# EAGLE design zegarek_v1.0 (EAGLE 6.2)
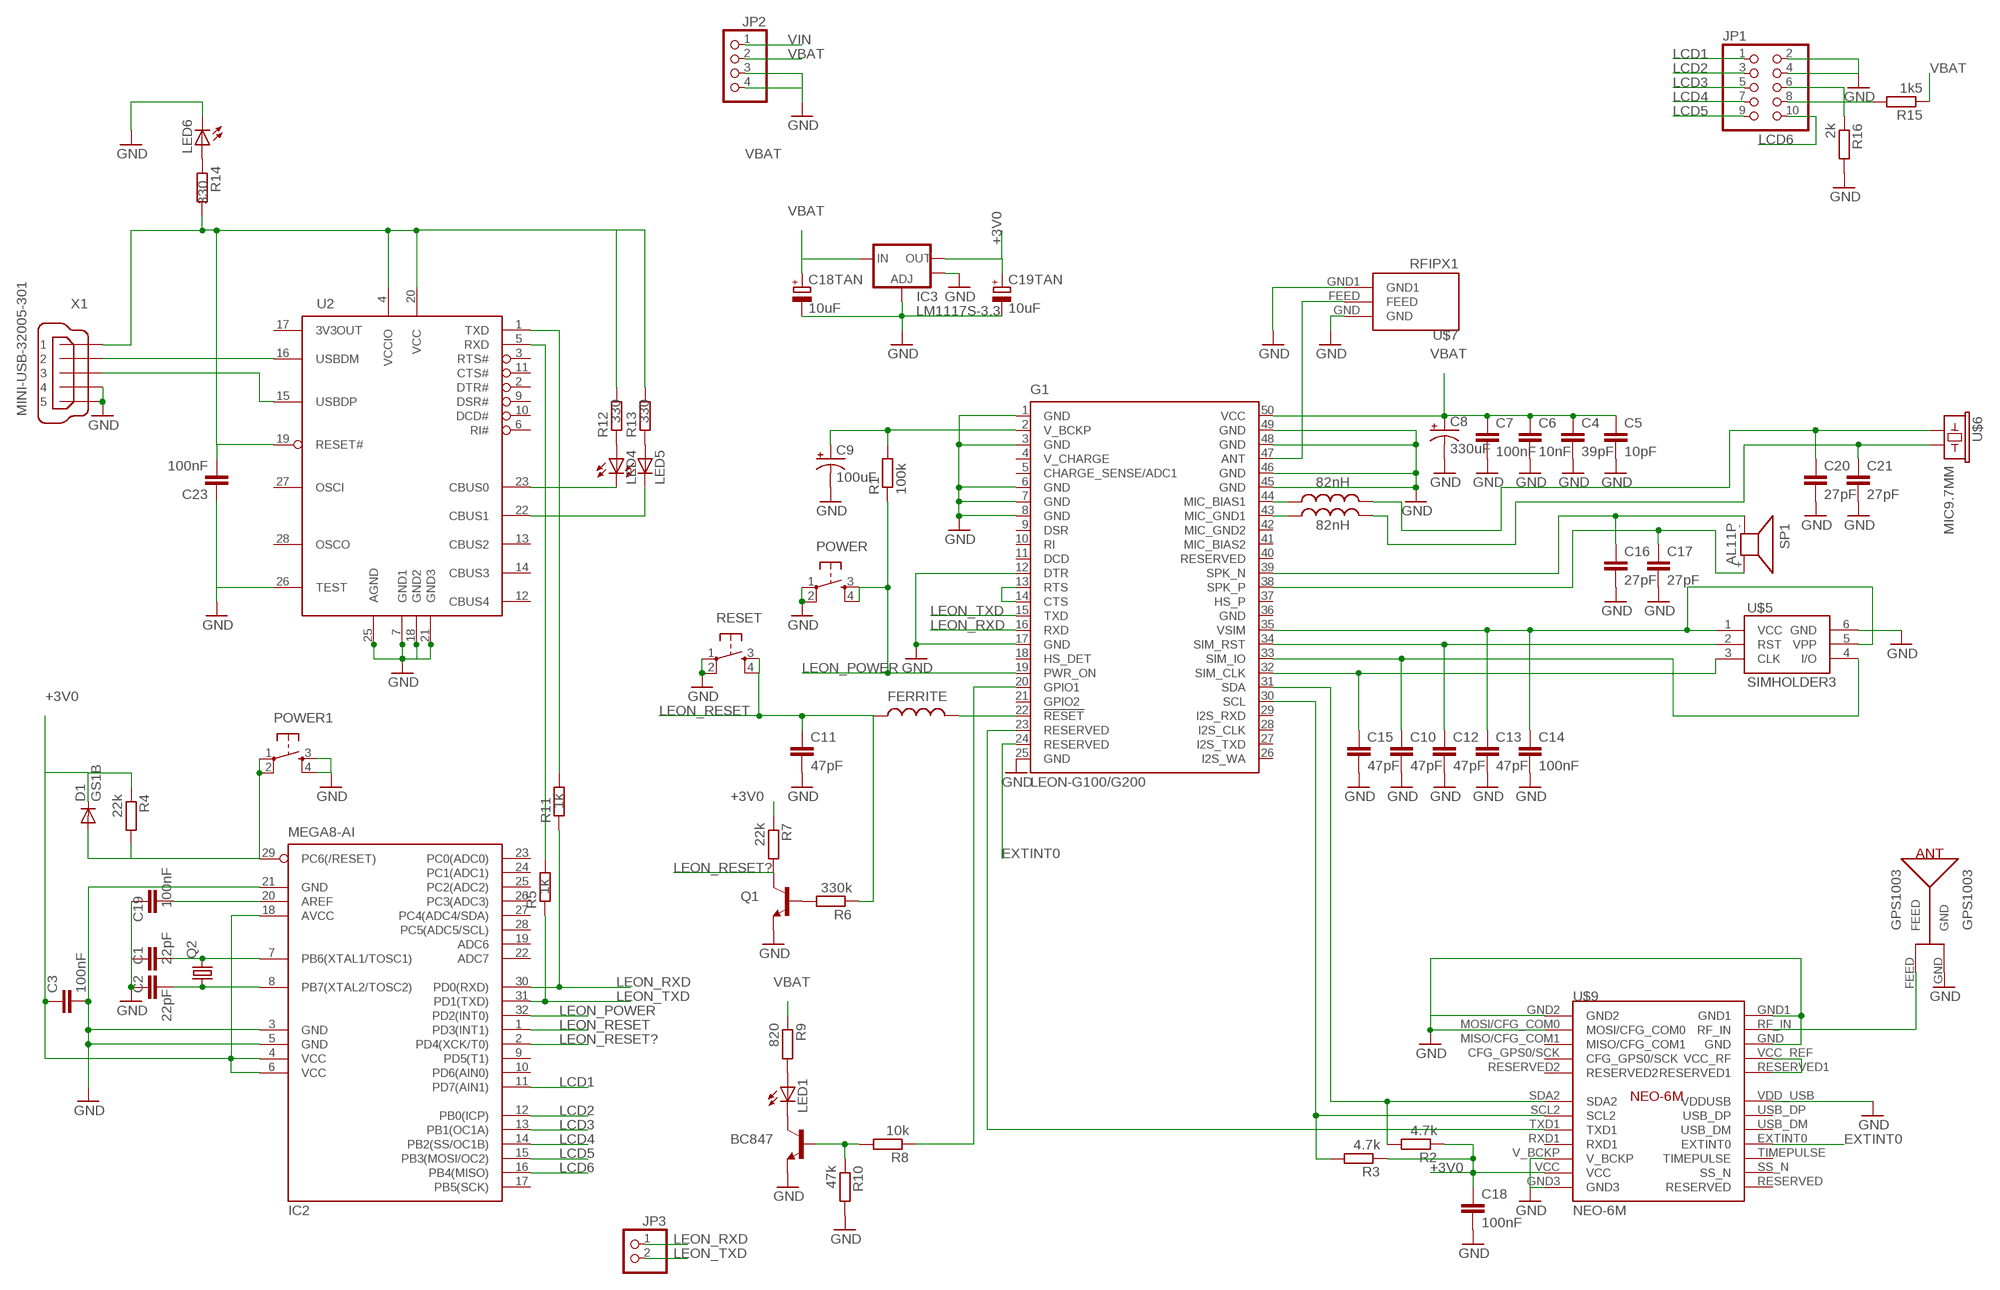
[diagram p0: schematic, sheet 1]

## Parts
BC847  TRANSISTOR_NPNSOT23  [SOT23]
C1  22pF  C-EUC0805  [C0805]
C2  22pF  C-EUC0805  [C0805]
C3  100nF  C-EUC0805  [C0805]
C4  39pF  C-EUC0805  [C0805]
C5  10pF  C-EUC0805  [C0805]
C6  10nF  C-EUC0805  [C0805]
C7  100nF  C-EUC0805  [C0805]
C8  330uF  CPOL-USTT2D6  [TT2D6]
C9  100uF  CPOL-USTT2D6  [TT2D6]
C10  47pF  C-EUC0805  [C0805]
C11  47pF  C-EUC0805  [C0805]
C12  47pF  C-EUC0805  [C0805]
C13  47pF  C-EUC0805  [C0805]
C14  100nF  C-EUC0805  [C0805]
C15  47pF  C-EUC0805  [C0805]
C16  27pF  C-EUC0805  [C0805]
C17  27pF  C-EUC0805  [C0805]
C18  100nF  C-EUC0805  [C0805]
C18TAN  10uF  CPOL-EUSMCA  [SMC_A]
C19  100nF  C-EUC0805  [C0805]
C19TAN  10uF  CPOL-EUSMCA  [SMC_A]
C20  27pF  C-EUC0805  [C0805]
C21  27pF  C-EUC0805  [C0805]
C23  100nF  C-EUC0805  [C0805]
D1  GS1B  DIODE-DO214AC  [DO214AC]
FERRITE  INDUCTOR0805  [0805]
FERRITE1  82nH  INDUCTOR0805  [0805]
FERRITE2  82nH  INDUCTOR0805  [0805]
G1  LEON-G100/G200  [LEON-G100/G200]
GPS1003  GPS1003  [GPS1003]
IC2  MEGA8-AI  [TQFP32-08]
IC3  LM1117S-3.3  V_REG_LM1117SOT223  [SOT223]
JP1  PINHD-2X5  [2X05]
JP2  PINHD-1X4  [1X04]
JP3  PINHD-1X2  [1X02]
LED1  LEDSMT1206  [1206]
LED4  LEDSMT1206  [1206]
LED5  LEDSMT1206  [1206]
LED6  LEDSMT1206  [1206]
POWER  TAC_SWITCHSMD  [TACTILE_SWITCH_SMD]
POWER1  TAC_SWITCHSMD  [TACTILE_SWITCH_SMD]
Q1  TRANSISTOR_NPNSOT23  [SOT23]
Q2  CRYSTALHC49S  [HC49/S]
R1  100k  R-EU_R0805  [R0805]
R2  4.7k  R-EU_R0805  [R0805]
R3  4.7k  R-EU_R0805  [R0805]
R4  22k  R-EU_R0805  [R0805]
R5  1k  R-EU_R0805  [R0805]
R6  330k  R-EU_R0805  [R0805]
R7  22k  R-EU_R0805  [R0805]
R8  10k  R-EU_R0805  [R0805]
R9  820  R-EU_R0805  [R0805]
R10  47k  R-EU_R0805  [R0805]
R11  1k  R-EU_R0805  [R0805]
R12  330  R-EU_R0805  [R0805]
R13  330  R-EU_R0805  [R0805]
R14  330  R-EU_R0805  [R0805]
R15  1k5  R-EU_R0805  [R0805]
R16  2k  R-EU_R0805  [R0805]
RESET  TAC_SWITCHSMD  [TACTILE_SWITCH_SMD]
SP1  AL11P  [AL11P]
U2  FT232RL  [SSOP28DB]
U$5  SIMHOLDER3  [SIMHOLDER3]
U$6  MIC9.7MM  [MIC-9.7MM]
U$7  RFIPX1  [RF-IPX1]
U$9  NEO-6M  [NEO-6M]
X1  MINI-USB-32005-301  [32005-301]

## Nets
+3V0: C3.1 C18.1 C19TAN.+ D1.C IC2.4(VCC) IC2.6(VCC) IC2.18(AVCC) IC3.2(OUT) R2.1 R3.1 R4.1 R7.1 U$9.VCC
EXTINT0: G1.24(RESERVED) U$9.EXTINT0
GND: BC847.2(E) C1.1 C2.1 C3.2 C4.2 C5.2 C6.2 C7.2 C8.- C9.- C10.2 C11.2 C12.2 C13.2 C14.2 C15.2 C16.2 C17.2 C18.2 C18TAN.- C19.2 C19TAN.- C20.2 C21.2 C23.1 G1.1(GND) G1.3(GND) G1.6(GND) G1.7(GND) G1.8(GND) G1.12(DTR) G1.17(GND) G1.25(GND) G1.45(GND) G1.46(GND) G1.48(GND) G1.49(GND) GPS1003.GND IC2.3(GND) IC2.5(GND) IC2.21(GND) IC3.1(ADJ) IC3.4(OUT) JP1.2 JP1.4 JP2.3 LED6.C POWER1.3 POWER1.4 POWER.1 POWER.2 Q1.2(E) R10.2 R16.2 RESET.1 RESET.2 U2.7(GND1) U2.18(GND2) U2.21(GND3) U2.25(AGND) U2.26(TEST) U$5.6(GND) U$7.GND U$7.GND1 U$9.GND U$9.GND1 U$9.GND2 U$9.GND3 U$9.MOSI/CFG_COM0 U$9.V_BCKP U$9.VDD_USB(VDDUSB) X1.4 X1.5
LCD1: IC2.11(PD7(AIN1)) JP1.1
LCD2: IC2.12(PB0(ICP)) JP1.3
LCD3: IC2.13(PB1(OC1A)) JP1.5
LCD4: IC2.14(PB2(SS/OC1B)) JP1.7
LCD5: IC2.15(PB3(MOSI/OC2)) JP1.9
LCD6: IC2.16(PB4(MISO)) JP1.10
LEON_POWER: G1.19(PWR_ON) IC2.32(PD2(INT0)) POWER.3 POWER.4 R1.1
LEON_RESET: C11.1 FERRITE.1 IC2.1(PD3(INT1)) R6.1 RESET.3 RESET.4
LEON_RESET?: IC2.2(PD4(XCK/T0)) Q1.3(C) R7.2
LEON_RXD: G1.16(RXD) IC2.30(PD0(RXD)) JP3.1 R11.1
LEON_TXD: G1.15(TXD) IC2.31(PD1(TXD)) JP3.2 R5.1
N$1: FERRITE.2 G1.22(!RESET)
N$2: C2.2 IC2.8(PB7(XTAL2/TOSC2)) Q2.1
N$3: C9.+ G1.2(V_BCKP) R1.2
N$4: C13.1 C14.1 G1.35(VSIM) U$5.1(VCC) U$5.5(VPP)
N$5: C15.1 G1.32(SIM_CLK) U$5.3(CLK)
N$6: C12.1 G1.34(SIM_RST) U$5.2(RST)
N$7: C16.1 G1.39(SPK_N) SP1.-
N$8: C10.1 G1.33(SIM_IO) U$5.4(I/O)
N$9: C17.1 G1.38(SPK_P) SP1.+
N$10: G1.13(RTS) G1.14(CTS)
N$11: FERRITE1.1 G1.44(MIC_BIAS1)
N$12: FERRITE2.1 G1.43(MIC_GND1)
N$13: C20.1 FERRITE1.2 U$6.1
N$14: C21.1 FERRITE2.2 U$6.2
N$15: Q1.1(B) R6.2
N$16: BC847.1(B) R8.2 R10.1
N$17: LED1.A R9.2
N$18: BC847.3(C) LED1.C
N$19: G1.20(GPIO1) R8.1
N$20: G1.47(ANT) U$7.FEED
N$21: JP1.6 R16.1
N$23: GPS1003.FEED U$9.RF_IN
N$24: G1.31(SDA) R2.2 U$9.SDA2
N$25: U$9.RESERVED1 U$9.VCC_REF(VCC_RF)
N$26: G1.30(SCL) R3.2 U$9.SCL2
N$27: G1.23(RESERVED) U$9.TXD1
N$28: C1.2 IC2.7(PB6(XTAL1/TOSC1)) Q2.2
N$29: D1.A IC2.29(PC6(/RESET)) POWER1.1 POWER1.2 R4.2
N$30: C19.1 IC2.20(AREF)
N$31: LED4.A R12.1
N$32: LED5.A R13.1
N$33: LED4.C U2.23(CBUS0)
N$34: LED5.C U2.22(CBUS1)
N$35: R11.2 U2.1(TXD)
N$36: R5.2 U2.5(RXD)
N$38: JP1.8 R15.2
N$40: JP2.4
N$47: C23.2 R12.2 R13.2 R14.2 U2.4(VCCIO) U2.19(RESET#) U2.20(VCC) X1.1
N$48: U2.16(USBDM) X1.2
N$49: U2.15(USBDP) X1.3
N$51: LED6.A R14.1
VBAT: C4.1 C5.1 C6.1 C7.1 C8.+ C18TAN.+ G1.50(VCC) IC3.3(IN) JP2.2 R9.1 R15.1
VIN: JP2.1
Unconnected: G1.4(V_CHARGE) G1.5(CHARGE_SENSE/ADC1) G1.9(DSR) G1.10(RI) G1.11(DCD) G1.18(HS_DET) G1.21(GPIO2) G1.26(I2S_WA) G1.27(I2S_TXD) G1.28(I2S_CLK) G1.29(I2S_RXD) G1.37(HS_P) G1.40(RESERVED) G1.41(MIC_BIAS2) G1.42(MIC_GND2) IC2.9(PD5(T1)) IC2.10(PD6(AIN0)) IC2.17(PB5(SCK)) IC2.19(ADC6) IC2.22(ADC7) IC2.23(PC0(ADC0)) IC2.24(PC1(ADC1)) IC2.25(PC2(ADC2)) IC2.26(PC3(ADC3)) IC2.27(PC4(ADC4/SDA)) IC2.28(PC5(ADC5/SCL)) U2.2(DTR#) U2.3(RTS#) U2.6(RI#) U2.9(DSR#) U2.10(DCD#) U2.11(CTS#) U2.12(CBUS4) U2.13(CBUS2) U2.14(CBUS3) U2.17(3V3OUT) U2.27(OSCI) U2.28(OSCO) U$9.CFG_GPS0/SCK U$9.MISO/CFG_COM1 U$9.RESERVED U$9.RESERVED2 U$9.RXD1 U$9.SS_N U$9.TIMEPULSE U$9.USB_DM U$9.USB_DP

## Power pins joined to a net without a drawn wire
GND: G1.36(GND)

## Library data of the parts
BC847 Q1 = SparkFun:TRANSISTOR_NPN: Transistor NPN BJT configuration in SOT23 package. MMBT2222 is the common NPN we use. Double check BCE configuration again layout.
C1-C7 C10-C21 C23 = rcl:C-EU: CAPACITOR, European symbol
C8 C9 = rcl:CPOL-US: POLARIZED CAPACITOR, American symbol
C18TAN C19TAN = rcl:CPOL-EU: POLARIZED CAPACITOR, European symbol
D1 = diode:DIODE-: DIODE
FERRITE FERRITE1 FERRITE2 = SparkFun:INDUCTOR: Inductors Basic Inductor/Choke - 0603 and 1206. Footprints are not proven and vary greatly between part numbers.
G1 = u-blox-1:LEON-G100/G200: LEON-G100/G200 Quad Band GSM/GPRS Voice and Data Modules Source: http://www.u-blox.com; OC_FARNELL: unknown; OC_NEWARK: unknown
GPS1003 = u-blox_NEO-6M:GPS1003
IC2 = atmel:MEGA8: MICROCONTROLLER 8 Kbytes FLASH, 1 kbytes SRAM, 512 bytes EEPROM, USART, 6-channel 10 bit ADC, 2-channel 8 bit ADC Pin compatible with Atmega48, ATMega88, ATMega168 Source: avr.lbr; MPN: ATMEGA8-16AU; OC_FARNELL: 9171371; OC_NEWARK: 73M8863
IC3 = SparkFun:V_REG_LM1117: Voltage Regulator LM1117 Standard adjustable voltage regulator but in SMD form. Spark Fun Electronics SKU : COM-00595
JP1 = pinhead:PINHD-2X5: PIN HEADER
JP2 = pinhead:PINHD-1X4: PIN HEADER
JP3 = pinhead:PINHD-1X2: PIN HEADER
LED1 LED4-LED6 = led:LED: LED OSRAM: - CHIPLED LG R971, LG N971, LY N971, LG Q971, LY Q971, LO R971, LY R971 LH N974, LH R974 LS Q976, LO Q976, LY Q976 LO Q996 - Hyper CHIPLED LW Q18S LB Q993, LB Q99A, LB R99A - SideLED LS A670, LO A670, LY A670, LG A670, LP A670 LB A673, LV A673, LT A673, LW A673 LH A674 LY A675 LS A676, LA A676, LO A676, LY A676, LW A676 LS A679, LY A679, LG A679 - Hyper Micro SIDELED® LS Y876, LA Y876, LO Y876, LY Y876 LT Y87S - SmartLED LW L88C, LW L88S LB L89C, LB L89S, LG L890 LS L89K, LO L89K, LY L89K LS L896, LA L896, LO L896, LY L896 - TOPLED LS T670, LO T670, LY T670, LG T670, LP T670 LSG T670, LSP T670, LSY T670, LOP T670, LYG T670 LG T671, LOG T671, LSG T671 LB T673, LV T673, LT T673, LW T673 LH T674 LS T676, LA T676, LO T676, LY T676, LB T676, LH T676, LSB T676, LW T676 LB T67C, LV T67C, LT T67C, LS T67K, LO T67K, LY T67K, LW E67C LS E67B, LA E67B, LO E67B, LY E67B, LB E67C, LV E67C, LT E67C LW T67C LS T679, LY T679, LG T679 LS T770, LO T770, LY T770, LG T770, LP T770 LB T773, LV T773, LT T773, LW T773 LH T774 LS E675, LA E675, LY E675, LS T675 LS T776, LA T776, LO T776, LY T776, LB T776 LHGB T686 LT T68C, LB T68C - Hyper Mini TOPLED® LB M676 - Mini TOPLED Santana® LG M470 LS M47K, LO M47K, LY M47K Source: http://www.osram.convergy.de LUXEON: - LUMILED® LXK2-PW12-R00, LXK2-PW12-S00, LXK2-PW14-U00, LXK2-PW14-V00 LXK2-PM12-R00, LXK2-PM12-S00, LXK2-PM14-U00 LXK2-PE12-Q00, LXK2-PE12-R00, LXK2-PE12-S00, LXK2-PE14-T00, LXK2-PE14-U00 LXK2-PB12-K00, LXK2-PB12-L00, LXK2-PB12-M00, LXK2-PB14-N00, LXK2-PB14-P00, LXK2-PB14-Q00 LXK2-PR12-L00, LXK2-PR12-M00, LXK2-PR14-Q00, LXK2-PR14-R00 LXK2-PD12-Q00, LXK2-PD12-R00, LXK2-PD12-S00 LXK2-PH12-R00, LXK2-PH12-S00 LXK2-PL12-P00, LXK2-PL12-Q00, LXK2-PL12-R00 Source: www.luxeon.com KINGBRIGHT: KA-3528ASYC Source: www.kingbright.com
POWER POWER1 RESET = SparkFun:TAC_SWITCH: Momentary Switch Button commonly used for reset or general input. Spark Fun Electronics SKU : COM-00097
Q2 = crystal:CRYSTAL: CRYSTAL; OC_FARNELL: 1667008; OC_NEWARK: unknown
R1-R16 = rcl:R-EU_: RESISTOR, European symbol
SP1 = buzzer:AL11P: SPEAKER Source: Buerklin; OC_FARNELL: unknown; OC_NEWARK: unknown
U2 = ftdichip-5:FT232RL: USB UART 4th Generation USB UART (USB <-> Serial) Controller
U$5 = SparkFun:SIMHOLDER3
U$6 = SparkFun:MIC: Microphone Omni-directional electret microphone. 9.7mm standard diameter.
U$7 = RFIPX:RFIPX1
U$9 = u-blox_NEO-6M:NEO-6M
X1 = con-cypressindustries:MINI-USB-: MINI USB-B Conector Source: www.cypressindustries.com; OC_FARNELL: unknown; OC_NEWARK: unknown

## Net classes
0 default: width 0.203 mm

## Board
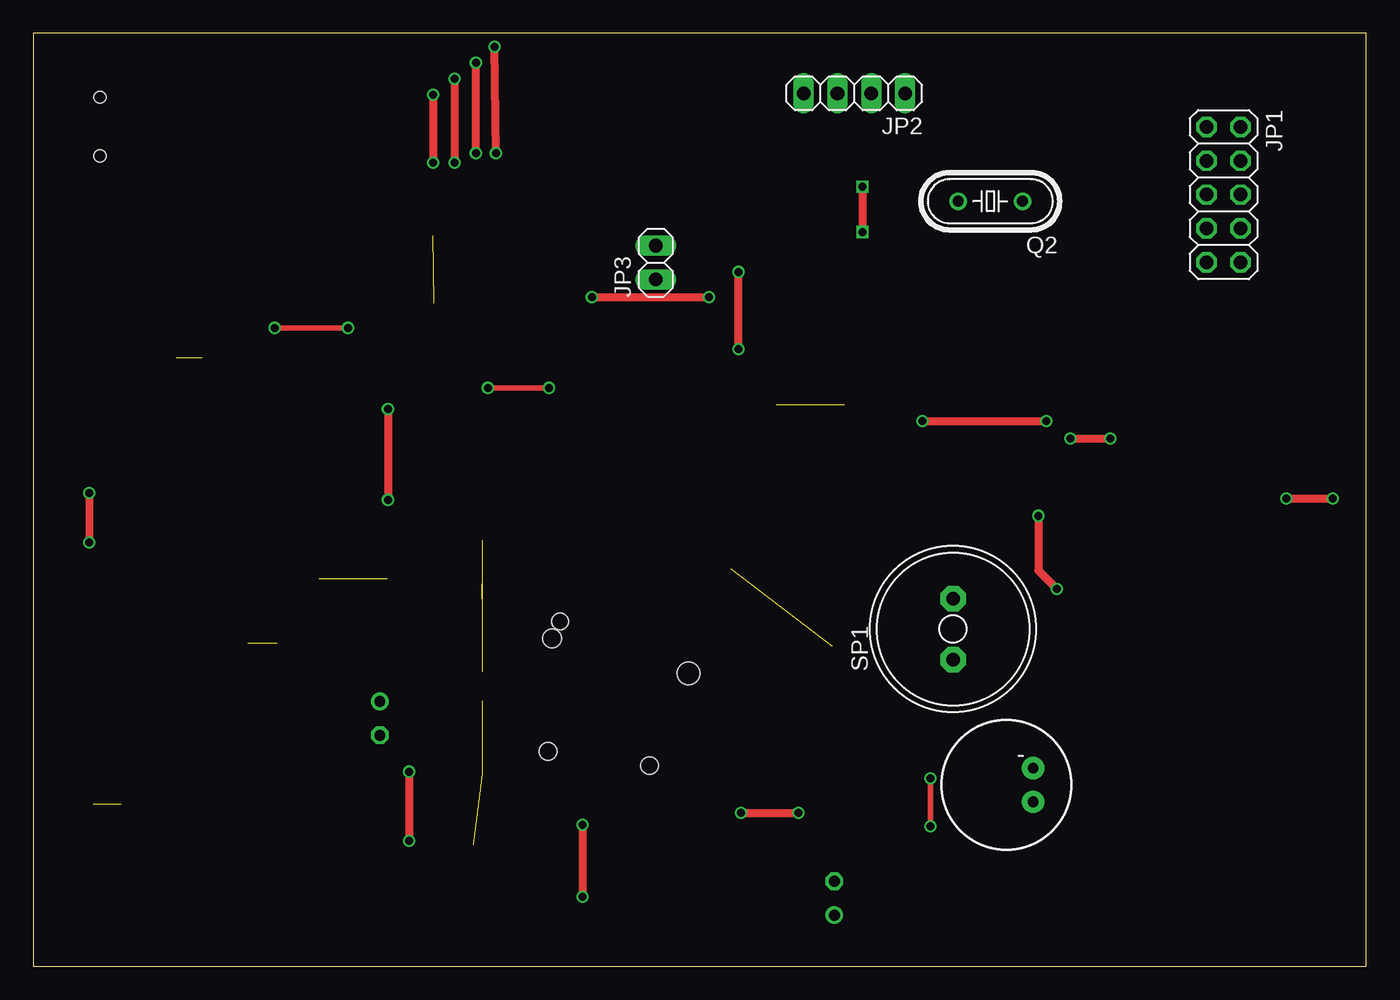
[diagram p1: board, top side]
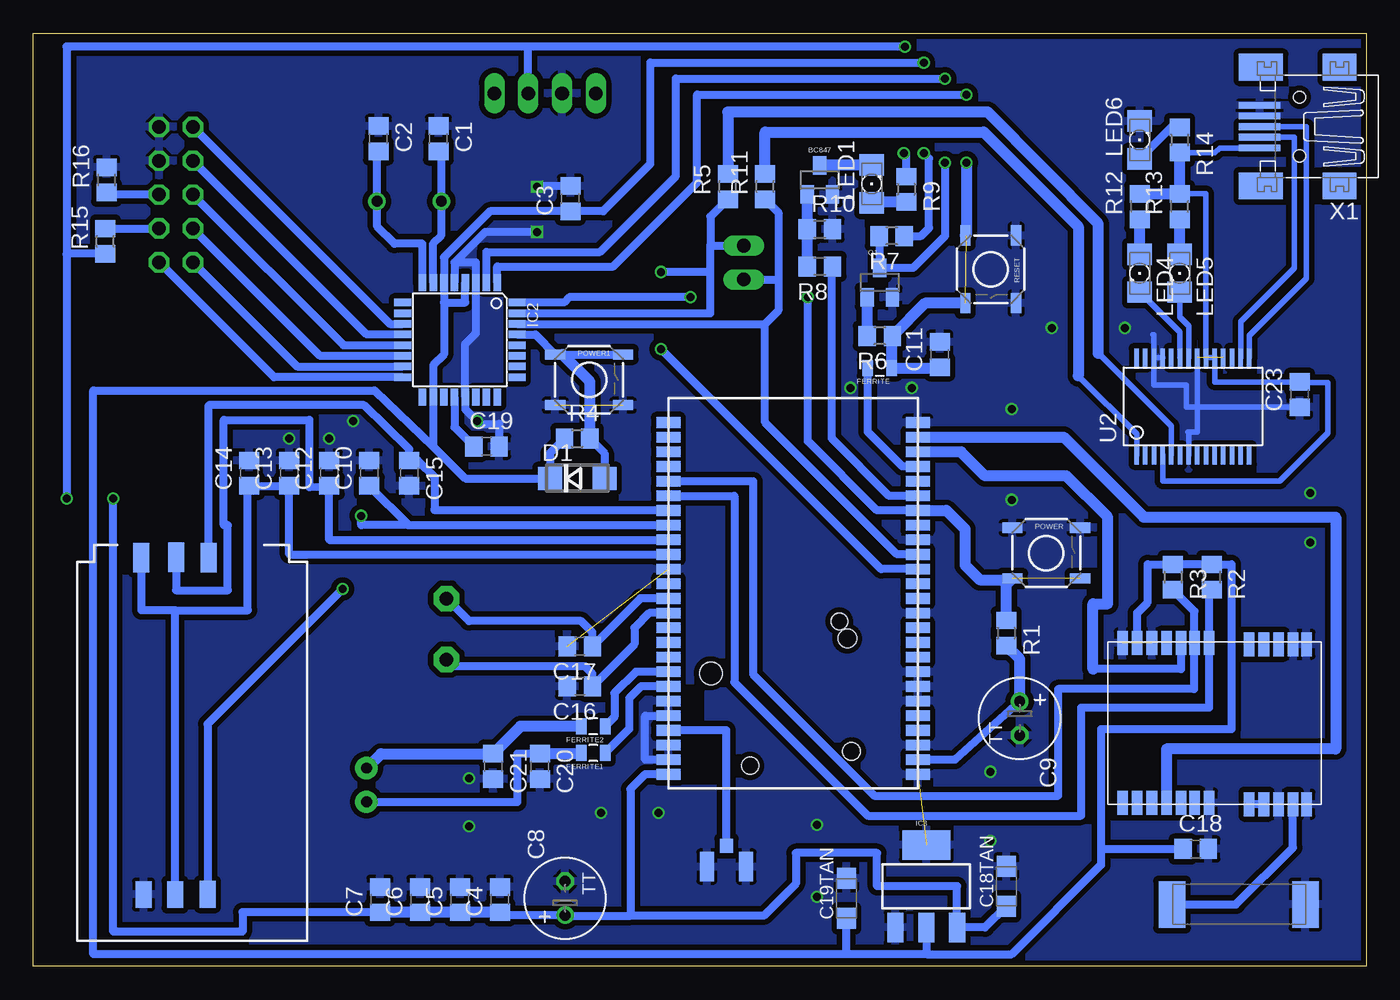
[diagram p2: board, bottom side, seen from below]

Size 100 x 70 mm. Coordinates in mm from the lower left corner, seen from the top.
Outline: 0,0 100,0 100,70 0,70 0,0
Copper layers (1*16): Top 0.035mm / dielectric 1.5mm / Bottom 0.035mm
Design rules: minimum track width 6mil, minimum drill 12mil, track to track 6mil, track to pad 6mil, pad to pad 6mil, via to via 6mil, smd to smd 0mil, copper to edge 10mil, drill to drill 10mil, minimum pad ring 10mil, minimum via ring 6mil, stop-mask expansion 2mil, vias tented up to drill 100mil, thermal gap 10mil

### Footprints (pad centres in the part's own frame; a part is rotated, then mirrored left to right if it is on the bottom)
SOT23 = smd 1 x 1.4: 1 -0.95,-1.1; 2 0.95,-1.1; 3 0,1.1
C0805 = smd 1.3 x 1.5: 1 -0.95,0; 2 0.95,0
TT2D6 = drill 0.813: + -1.27,0 | drill 0.813 octagon: - 1.27,0
SMC_A = smd 1.6 x 1.4: + -1.5,0; - 1.5,0
DO214AC = smd 1.8 x 1.7: A 2.05,0; C -2.05,0
0805 = smd 0.8 x 1.2: 1 -0.9,0; 2 0.9,0
LEON-G100/G200 = smd 1.8 x 0.8: 1 -9.35,13.6; 2 -9.35,12.5; 3 -9.35,11.4; 4 -9.35,10.3; 5 -9.35,9.2; 6 -9.35,8.1; 7 -9.35,7; 8 -9.35,5.9; 9 -9.35,4.8; 10 -9.35,3.7; 11 -9.35,2.6; 12 -9.35,1.5; 13 -9.35,0.4; 14 -9.35,-0.7; 15 -9.35,-1.8; 16 -9.35,-2.9; 17 -9.35,-4; 18 -9.35,-5.1; 19 -9.35,-6.2; 20 -9.35,-7.3; 21 -9.35,-8.4; 22 -9.35,-9.5; 23 -9.35,-10.6; 24 -9.35,-11.7; 25 -9.35,-12.8; 26 9.35,-12.8; 27 9.35,-11.7; 28 9.35,-10.6; 29 9.35,-9.5; 30 9.35,-8.4; 31 9.35,-7.3; 32 9.35,-6.2; 33 9.35,-5.1; 34 9.35,-4; 35 9.35,-2.9; 36 9.35,-1.8; 37 9.35,-0.7; 38 9.35,0.4; 39 9.35,1.5; 40 9.35,2.6; 41 9.35,3.7; 42 9.35,4.8; 43 9.35,5.9; 44 9.35,7; 45 9.35,8.1; 46 9.35,9.2; 47 9.35,10.3; 48 9.35,11.4; 49 9.35,12.5; 50 9.35,13.6 | hole 1.31: -4.39,11.88 | hole 1.29: 3.23,12.96 | hole 1.7: 6.16,6.02 | hole 1.4: -4.07,3.42 | hole 1.24: -3.47,2.12
GPS1003 = smd 3.5 x 2: FEED 0.23,4.96; GND 0.23,-5.04
TQFP32-08 = smd 1.27 x 0.559: 1 -4.293,2.8; 2 -4.293,2; 3 -4.293,1.2; 4 -4.293,0.4; 5 -4.293,-0.4; 6 -4.293,-1.2; 7 -4.293,-2; 8 -4.293,-2.8; 17 4.293,-2.8; 18 4.293,-2; 19 4.293,-1.2; 20 4.293,-0.4; 21 4.293,0.4; 22 4.293,1.2; 23 4.293,2; 24 4.293,2.8 | smd 0.559 x 1.27: 9 -2.8,-4.293; 10 -2,-4.293; 11 -1.2,-4.293; 12 -0.4,-4.293; 13 0.4,-4.293; 14 1.2,-4.293; 15 2,-4.293; 16 2.8,-4.293; 25 2.8,4.293; 26 2,4.293; 27 1.2,4.293; 28 0.4,4.293; 29 -0.4,4.293; 30 -1.2,4.293; 31 -2,4.293; 32 -2.8,4.293
SOT223 = smd 1.219 x 2.235: 1 -2.311,-3.099; 2 0,-3.099; 3 2.311,-3.099 | smd 3.6 x 2.2: 4 0,3.099
2X05 = drill 1.016 octagon: 1 -5.08,-1.27; 2 -5.08,1.27; 3 -2.54,-1.27; 4 -2.54,1.27; 5 0,-1.27; 6 0,1.27; 7 2.54,-1.27; 8 2.54,1.27; 9 5.08,-1.27; 10 5.08,1.27
1X04 = drill 1.016 long: 1 -3.81,0; 2 -1.27,0; 3 1.27,0; 4 3.81,0
1X02 = drill 1.016 long: 1 -1.27,0; 2 1.27,0
1206 = smd 1.6 x 1.803: A -1.422,0; C 1.422,0
TACTILE_SWITCH_SMD = smd 1.524 x 0.762: 1 -2.54,1.905; 2 2.54,1.905; 3 -2.54,-1.905; 4 2.54,-1.905
HC49/S = drill 0.813: 1 -2.413,0; 2 2.413,0
R0805 = smd 1.3 x 1.5: 1 -0.95,0; 2 0.95,0
AL11P = drill 1.016 pad 1.905 octagon: + 2.286,0; - -2.286,0
SSOP28DB = smd 0.348 x 1.397: 1 -4.225,-3.656; 2 -3.575,-3.656; 3 -2.925,-3.656; 4 -2.275,-3.656; 5 -1.625,-3.656; 6 -0.975,-3.656; 7 -0.325,-3.656; 8 0.325,-3.656; 9 0.975,-3.656; 10 1.625,-3.656; 11 2.275,-3.656; 12 2.925,-3.656; 13 3.575,-3.656; 14 4.225,-3.656; 15 4.225,3.656; 16 3.575,3.656; 17 2.925,3.656; 18 2.275,3.656; 19 1.625,3.656; 20 0.975,3.656; 21 0.325,3.656; 22 -0.325,3.656; 23 -0.975,3.656; 24 -1.625,3.656; 25 -2.275,3.656; 26 -2.925,3.656; 27 -3.575,3.656; 28 -4.225,3.656
SIMHOLDER3 = smd 2.2 x 1.2: 1 0.95,4.81; 2 0.91,7.41; 3 0.95,9.86 | smd 2 x 1.2: 4 26.2,9.78; 5 26.22,7.34; 6 26.22,4.98
MIC-9.7MM = drill 0.8 pad 1.676: 1 -2,1.27; 2 -2,-1.27
RF-IPX1 = smd 1 x 1.05: FEED 0,-1.05 | smd 1.05 x 2.2: GND 1.475,0.525; GND1 -1.475,0.525
NEO-6M = smd 0.8 x 1.8: CFG_GPS0/SCK -3.32,-6.15; EXTINT0 3.98,5.75; GND -4.42,5.85; GND1 -6.52,5.85; GND2 -6.52,-6.15; GND3 7.28,-6.25; MISO/CFG_COM1 -4.42,-6.15; MOSI/CFG_COM0 -5.52,-6.15; RESERVED 7.28,5.75; RESERVED1 -2.22,5.85; RESERVED2 -2.22,-6.15; RF_IN -5.52,5.85; RXD1 3.98,-6.25; SCL2 1.88,-6.25; SDA2 0.78,-6.25; SS_N 6.18,5.75; TIMEPULSE 5.08,5.75; TXD1 2.88,-6.25; USB_DM 2.88,5.75; USB_DP 1.88,5.75; V_BCKP 5.08,-6.25; VCC 6.18,-6.25; VCC_REF -3.32,5.85; VDD_USB 0.78,5.75
32005-301 = smd 3.1 x 0.5: 1 3,1.6; 2 3,0.8; 3 3,0; 4 3,-0.8; 5 3,-1.6 | smd 2.5 x 2: M1 -3,-4.45; M2 -3,4.45 | smd 3.3 x 2: M3 2.9,4.45; M4 2.9,-4.45 | hole 0.9: 0,2.2; 0,-2.2

### Placement (x,y rotation side)
BC847  41,59 0 bottom
C1  69.6,62.1 270 bottom
C2  74.1,62.1 270 bottom
C3  59.7,57.6 90 bottom
C4  65,5 90 bottom
C5  68,5 90 bottom
C6  71,5 90 bottom
C7  74,5 90 bottom
C8  60.1,5.1 90 bottom
C9  26,18.6 270 bottom
C10  74.8,37 90 bottom
C11  32,45.9 90 bottom
C12  77.8,37 90 bottom
C13  80.8,37 90 bottom
C14  83.8,37 90 bottom
C15  71.8,37 270 bottom
C16  59,21 180 bottom
C17  59,24 180 bottom
C18  12.8,8.8 0 bottom
C18TAN  27,6 90 bottom
C19  66,39 0 bottom
C19TAN  39,5.1 90 bottom
C20  62,15 270 bottom
C21  65.5,15 270 bottom
C23  5,42.9 90 bottom
D1  59.2,36.6 0 bottom
FERRITE  36.5,44.9 180 bottom
FERRITE1  58,16 180 bottom
FERRITE2  58,18 180 bottom
G1  43,28 180 bottom
GPS1003  9.6,4.4 90 bottom
IC2  68,47 270 bottom
IC3  33,6 0 bottom
JP1  89.3,57.9 270 top
JP2  61.6,65.5 180 top
JP3  46.7,52.8 90 top
LED1  37.1,58.7 90 bottom
LED4  17,52 270 bottom
LED5  14,52 270 bottom
LED6  17,62 90 bottom
POWER  24,31 0 bottom
POWER1  58.3,44 0 bottom
Q1  36.5,51.3 0 bottom
Q2  71.8,57.4 180 top
R1  27,25 270 bottom
R2  11.6,29.2 270 bottom
R3  14.5,29.2 270 bottom
R4  59.2,39.6 0 bottom
R5  47.9,58.5 90 bottom
R6  36.5,47.3 180 bottom
R7  35.6,54.8 180 bottom
R8  41,52.5 180 bottom
R9  34.5,58.3 270 bottom
R10  41,55.3 0 bottom
R11  45.1,58.5 90 bottom
R12  17,57 90 bottom
R13  14,57 90 bottom
R14  14,62 270 bottom
R15  94.6,54.4 90 bottom
R16  94.5,59 90 bottom
RESET  28.17,52.3 270 bottom
SP1  69,25.3 90 top
U2  13,42 0 bottom
U$5  96.7,31.6 270 bottom
U$6  73,13.6 180 top
U$7  48,8 180 bottom
U$9  11,18 180 bottom
X1  5,63 180 bottom

### Tracks (layer width: path | path; a pad name or v marks a point on that pad's centre or on a via)
+3V0  (via drill 0.6)
  Top 0.61: v33.2,61 v33.2,67.8
  Bottom 0.61: R2.1 R3.1 16.4,30.15 16.4,27.3 17.18,26.52 U$9.VCC | 19.9,8.8 19.9,17.8 10.1,17.8 10.1,30.15 R2.1 | 19.9,8.8 19.9,7.6 26.6,0.9 33,0.9 | 19.9,8.8 C18.1 | 33,0.9 39,0.9 | 39,0.9 C19TAN.+ | IC3.2 33,0.9 | 70,39 IC2.18 70,45.1 69.2,45.9 IC2.6 | 70,39 67.6,36.6 D1.C 61.25,38.5 R4.1 | IC2.6 69.2,49.8 67.6,49.8 IC2.4 | IC2.6 69.2,53.2 65.75,56.65 C3.1 57.25,56.65 53.7,60.2 53.7,67.8 v33.2,67.8 | 11.55,30.2 R2.1 | 70,39 74.4,43.2 95.5,43.2 95.5,0.9 39.2,0.9 arc90 39,0.9 | R7.1 33.4,54.8 32.8,55.4 32.8,60.6 v33.2,61
EXTINT0
  Bottom 0.813: G1.24 22.7,39.7 16.7,33.7 2.3,33.7 2.3,16.3 14.98,16.3 U$9.EXTINT0
GND  (via drill 0.6)  (10 unrouted)
  Top 0.406: v34.1,43.4 v38.7,43.4 | v18.1,47.9 v23.6,47.9 | v67.3,14.1 v67.3,10.5
  Top 0.61: v41.2,10.6 v41.2,5.2 | v53.1,11.5 v57.4,11.5 | v26.6,41.8 v26.6,35 | v4.2,35.5 v4.2,31.8 | v28.2,14.6 v28.2,9.4 | v77.8,39.6 v80.8,39.6 | v66.7,40.9 v76,40.9 | v62.2,58.5 v62.2,55.1
  Bottom 0.406: U2.26 15.93,43.6 13.5,43.6 13.5,41.95 C23.1 | U2.26 15.93,47.4 16,47.4 | U2.21 12.68,40.1 13.4,40.1 arc90 13.32,40.02 U2.7 | U2.25 U2.26
  Bottom 0.61: G1.49 54.1,15.5 54.1,18.8 G1.46 | 68.4,52.8 66.8,52.8 IC2.3 66.8,47.5 67.6,46.7 IC2.21 67.6,41.8 v66.7,40.9 66.5,40.7 65.05,40.7 C19.2 | 68.4,52.8 IC2.5 | C3.2 62.15,58.55 v62.2,58.5 | v62.2,55.1 66.1,55.1 68.4,52.8
  pour Bottom (isolate 0.406): 0,70 100,70 100,0 0,0
LCD1
  Bottom 0.61: JP1.1 73.25,48.2 IC2.11
LCD2
  Bottom 0.61: IC2.12 74.99,47.4 JP1.3
LCD3
  Bottom 0.61: JP1.5 76.73,46.6 IC2.13
LCD4
  Bottom 0.61: IC2.14 78.47,45.8 JP1.7
LCD5
  Bottom 0.61: JP1.9 80.21,45 IC2.15
LCD6
  Bottom 0.61: IC2.16 81.95,44.2 JP1.10
LEON_POWER  (via drill 0.6)  (1 unrouted)
  Top 0.61: v41.9,50.2 v50.7,50.2
  Bottom 0.61: G1.19 36.7,34.2 41.9,39.4 v41.9,50.2 | v50.7,50.2 59.8,50.2 60.2,49.8 IC2.32
  Bottom 0.813: R1.1 27,28.64 POWER.3 26.64,29 29,29 30.1,30.1 30.1,32.8 31.5,34.2 G1.19
LEON_RESET  (via drill 0.6)  (1 unrouted)
  Top 0.61: v30,65.4 v30,60.3
  Bottom 0.61: IC2.1 65.2,52.5 56.5,52.5 50.2,58.8 50.2,65.4 v30,65.4
  Bottom 0.813: C11.1 32.05,44.9 FERRITE.1 35.6,47.25 R6.1 33.09,49.76 RESET.4 | v30,60.3 30,54.84 RESET.3
LEON_RESET?  (via drill 0.6)
  Top 0.61: v31.6,66.6 v31.6,60.3
  Bottom 0.61: IC2.2 66,53.6 57.5,53.6 51.8,59.3 51.8,66.6 v31.6,66.6 | v31.6,60.3 31.6,54.8 34,52.4 Q1.3 36.5,54.75 R7.2
LEON_RXD
  Bottom 0.61: IC2.30 45.1,48.2 | G1.16 35.2,30.9 45.1,40.8 45.1,48.2 | R11.1 44.1,56.55 44.1,51.5 | 44.1,51.5 44.1,49.2 45.1,48.2 | JP3.1 44.13,51.53 44.1,51.5
LEON_TXD  (via drill 0.6)
  Top 0.61: v52.9,46.3 v52.9,52.1
  Bottom 0.61: G1.15 36.4,29.8 v52.9,46.3 | IC2.31 49.2,49 49.2,52.1 | 49.2,52.1 v52.9,52.1 | 49.2,52.1 49.2,54.07 | 49.2,54.07 JP3.2 | R5.1 49.2,56.25 49.2,54.07
N$1
  Bottom 0.61: G1.22 34.8,37.5 37.4,40.1 FERRITE.2
N$2
  Bottom 0.61: IC2.8 70.8,54.2 72.9,54.2 74.2,55.5 74.2,57.39 Q2.1 74.21,61.04 C2.2
N$3
  Bottom 0.61: C9.+ 30.85,15.5 G1.2
  Bottom 0.813: C9.+ 26,23.05 R1.2
N$4
  Bottom 0.61: G1.35 80.8,30.9 C13.1 C14.1 83.9,36.05 83.9,26.7 89.36,26.7 | U$5.1 91.89,26.7 89.36,26.7 | U$5.5 89.36,26.7
N$5
  Bottom 0.61: G1.32 69.85,34.2 69.9,34.25 69.9,36.7 71.15,37.95 C15.1 71.8,38.8 75.2,42.1 86.84,42.1 U$5.3
N$6
  Bottom 0.61: G1.34 77.8,32 C12.1 79.3,35.95 79.3,41 85.7,41 85.7,33.1 85.4,33.1 85.4,28.2 89.29,28.2 U$5.2
N$7
  Bottom 0.61: G1.39 53.8,26.5 54.9,25.4 54.9,24.15 C16.1 58.05,21.95 58.6,22.5 68.49,22.5 SP1.-
N$8  (via drill 0.6)
  Top 0.61: v75.4,33.8 75.4,29.7 v76.8,28.3
  Bottom 0.61: C10.1 71.85,33.1 | 71.85,33.1 G1.33 | 71.85,33.1 75.4,33.1 v75.4,33.8 | v76.8,28.3 86.92,18.18 U$5.4
N$9
  Bottom 0.61: G1.38 54.45,27.6 C17.1 58.05,25.05 58.9,25.9 67.31,25.9 SP1.+
N$10  (1 unrouted)
N$11
  Bottom 0.61: G1.44 54.4,21 55.3,20.1 55.3,17.8 FERRITE1.1
N$12
  Bottom 0.61: G1.43 54.8,22.1 56.4,20.5 56.4,18.7 FERRITE2.1
N$13
  Bottom 0.61: C20.1 63.7,15.95 63.7,12.3 75,12.3 U$6.1
  Bottom 0.813: FERRITE1.2 58.95,15.95 C20.1
N$14
  Bottom 0.813: U$6.2 73.92,15.95 C21.1 63.45,18 FERRITE2.2
N$15
  Bottom 0.813: Q1.1 R6.2
N$16
  Bottom 0.813: BC847.1 R10.1 R8.2
N$17
  Bottom 0.813: R9.2 37.03,57.35 LED1.A
N$18
  Bottom 0.813: LED1.C BC847.3
N$19
  Bottom 0.61: G1.20 35.8,35.3 40.1,39.6 40.1,51.95 R8.1
N$20
  Bottom 0.61: U$7.FEED 48,17.7 G1.47
N$21
  Bottom 0.61: JP1.6 94.35,57.9 R16.1
N$23
  Bottom 0.61: GPS1003.FEED 9.77,4.63 5.5,8.9 5.5,12.13 U$9.RF_IN
N$24
  Bottom 0.61: 11.78,28.07 U$9.SDA2 11.78,19.4 21.4,19.4 21.4,11.3 37.4,11.3 47.4,21.3 47.4,35.3 G1.31
  Bottom 0.813: 11.78,28.07 R2.2
N$25
  Bottom 0.61: U$9.VCC_REF U$9.RESERVED1
N$26
  Bottom 0.61: U$9.SCL2 12.88,26.63 R3.2 | G1.30 46,36.4 46,21.9 36.9,12.8 23.1,12.8 23.1,20.8 12.9,20.8 12.9,24.25
  Bottom 0.813: 12.9,24.25 U$9.SCL2
N$27
  Bottom 0.61: U$9.TXD1 13.88,22.3 20.5,22.3
  Bottom 0.813: G1.23 30.4,38.6 28.6,36.8 22.5,36.8 19.4,33.7 19.4,27.2 20.5,27.2 20.5,22.3
N$28
  Bottom 0.61: IC2.7 70,54.25 69.39,54.86 Q2.2 69.39,61.15 C1.2
N$29
  Bottom 0.61: R4.2 57.15,38.5 D1.A | POWER1.2 60.3,45.91 POWER1.1 62.34,47.4 IC2.29
  Bottom 0.813: R4.2 58.25,43.85 60.3,45.91
N$30
  Bottom 0.61: IC2.20 68.4,40.45 C19.1
N$31
  Bottom 0.813: LED4.A R12.1
N$32
  Bottom 0.813: LED5.A R13.1
N$33
  Bottom 0.406: U2.23 13.97,47.48 14,47.5 14,47.58 LED4.C
N$34
  Bottom 0.406: U2.22 13.32,48.02 14,48.7 LED5.C
N$35
  Bottom 0.406: U2.1 17.23,39.92 21.6,44.3
  Bottom 0.813: R11.2 45.1,62.6 28.7,62.6 21.6,55.5 21.6,44.3
N$36
  Bottom 0.406: U2.5 14.62,40.52 20.1,46
  Bottom 0.813: 20.1,46 20.1,55.7 28.4,64.1 47.9,64.1 R5.2
N$38
  Bottom 0.61: R15.2 JP1.8 arc-90 JP1.8
N$47
  Bottom 0.406: R14.2 11.35,61.05 11,61.4 X1.1 | R13.2 12.03,57.95 U2.20 U2.19 11.38,43.85 C23.2 5,43.8 2.9,43.8 2.9,40 6.5,36.4 15.28,36.4 U2.4
  Bottom 0.813: R12.2 R13.2 R14.2
N$48
  Bottom 0.406: X1.2 5.4,62.2 5.4,52.4 9.43,48.38 U2.16
N$49
  Bottom 0.406: X1.3 4.5,63 4.5,51.6 8.78,47.33 U2.15
N$51
  Bottom 0.61: R14.1 14.63,62.95 LED6.A
VBAT  (via drill 0.6)
  Top 0.61: v34.7,61 v34.6,69 | v94,35.1 v97.5,35.1
  Bottom 0.61: C18TAN.+ 28.6,2.9 IC3.3 30.69,6 36.7,6 36.7,8.5 42.8,8.5 42.8,6.2 45.2,3.8 55.2,3.8 | G1.50 54.1,14.4 55.2,13.3 55.2,3.8 | 55.2,3.8 59.85,3.8 C8.+ 65,3.83 C4.1 | R9.1 34.5,60.8 v34.7,61 | C7.1 84.3,4.05 84.3,2.6 94,2.6 v94,35.1 | v34.6,69 62.9,69 | 62.9,69 97.5,69 97.5,53.4 | 97.5,53.4 v97.5,35.1 | JP2.2 62.9,65.53 62.9,69 | R15.1 97.45,53.45 arc-90 97.5,53.4
  Bottom 0.813: C4.1 C5.1 C6.1 C7.1